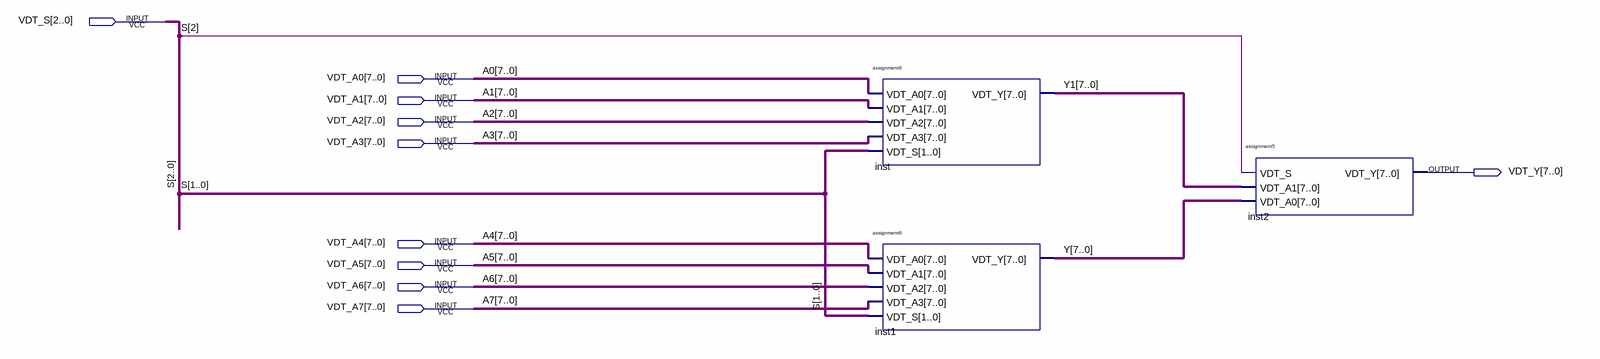
[diagram p0: schematic sheet]
// Quartus schematic mux818.bdf as structural Verilog: 3 symbols, 10 pins
module mux818 (
  input  [2:0] VDT_S,
  input  [7:0] VDT_A0,
  input  [7:0] VDT_A1,
  input  [7:0] VDT_A2,
  input  [7:0] VDT_A3,
  input  [7:0] VDT_A4,
  input  [7:0] VDT_A5,
  input  [7:0] VDT_A6,
  input  [7:0] VDT_A7,
  output [7:0] VDT_Y
);

  wire [7:0] Y, Y1;

  assignment6 inst (.VDT_A0(VDT_A0), .VDT_A1(VDT_A1), .VDT_A2(VDT_A2), .VDT_A3(VDT_A3), .VDT_S(VDT_S[1:0]), .VDT_Y(Y1));
  assignment6 inst1 (.VDT_A0(VDT_A4), .VDT_A1(VDT_A5), .VDT_A2(VDT_A6), .VDT_A3(VDT_A7), .VDT_S(VDT_S[1:0]), .VDT_Y(Y));
  assignment5 inst2 (.VDT_S(VDT_S[2]), .VDT_A1(Y1), .VDT_A0(Y), .VDT_Y(VDT_Y));

  // Other names for the same wires on the sheet: A0[7:0] = VDT_A0; A1[7:0] = VDT_A1; A2[7:0] = VDT_A2;
  //   A3[7:0] = VDT_A3; A4[7:0] = VDT_A4; A5[7:0] = VDT_A5; A6[7:0] = VDT_A6; A7[7:0] = VDT_A7; S[2:0] = VDT_S
endmodule
